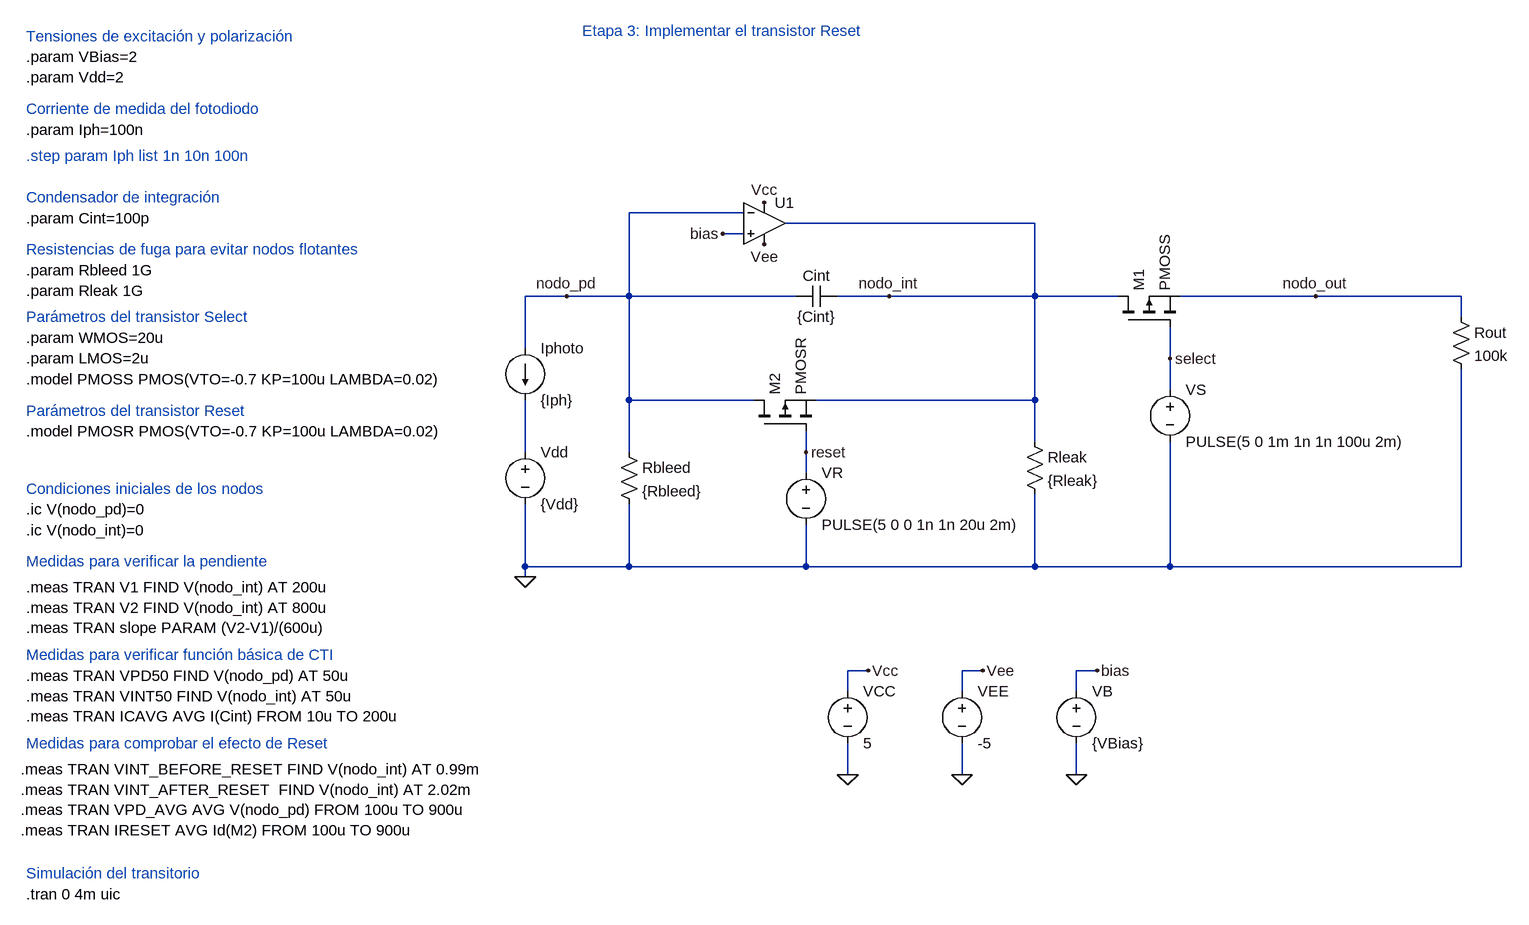
[diagram p0: schematic CTI_Definitivo.asc]
CTI_Definitivo.asc, the LTspice schematic file:
Version 4.1
SHEET 1 2360 1448
WIRE 416 384 240 384
WIRE 864 400 480 400
WIRE 416 416 384 416
WIRE 144 512 80 512
WIRE 240 512 240 384
WIRE 240 512 144 512
WIRE 496 512 240 512
WIRE 640 512 560 512
WIRE 864 512 864 400
WIRE 864 512 640 512
WIRE 992 512 864 512
WIRE 1296 512 1088 512
WIRE 1520 512 1296 512
WIRE 1520 544 1520 512
WIRE 80 592 80 512
WIRE 1072 608 1072 560
WIRE 1072 656 1072 608
WIRE 240 672 240 512
WIRE 432 672 240 672
WIRE 864 672 864 512
WIRE 864 672 528 672
WIRE 864 736 864 672
WIRE 80 752 80 672
WIRE 240 752 240 672
WIRE 512 752 512 720
WIRE 512 784 512 752
WIRE 80 928 80 832
WIRE 240 928 240 832
WIRE 240 928 80 928
WIRE 512 928 512 864
WIRE 512 928 240 928
WIRE 864 928 864 816
WIRE 864 928 512 928
WIRE 1072 928 1072 736
WIRE 1072 928 864 928
WIRE 1520 928 1520 624
WIRE 1520 928 1072 928
WIRE 80 944 80 928
WIRE 608 1088 576 1088
WIRE 784 1088 752 1088
WIRE 960 1088 928 1088
WIRE 576 1120 576 1088
WIRE 752 1120 752 1088
WIRE 928 1120 928 1088
WIRE 576 1248 576 1200
WIRE 752 1248 752 1200
WIRE 928 1248 928 1200
FLAG 80 944 0
FLAG 144 512 nodo_pd
FLAG 640 512 nodo_int
FLAG 960 1088 bias
FLAG 576 1248 0
FLAG 752 1248 0
FLAG 608 1088 Vcc
FLAG 784 1088 Vee
FLAG 448 368 Vcc
FLAG 448 432 Vee
FLAG 384 416 bias
FLAG 928 1248 0
FLAG 1072 608 select
FLAG 1296 512 nodo_out
FLAG 512 752 reset
SYMBOL voltage 928 1104 R0
SYMATTR InstName VB
SYMATTR Value {VBias}
SYMBOL current 80 592 R0
SYMATTR InstName Iphoto
SYMATTR Value {Iph}
SYMBOL cap 496 528 R270
WINDOW 0 32 32 VTop 2
WINDOW 3 0 32 VBottom 2
SYMATTR InstName Cint
SYMATTR Value {Cint}
SYMBOL res 224 736 R0
SYMATTR InstName Rbleed
SYMATTR Value {Rbleed}
SYMBOL res 848 720 R0
SYMATTR InstName Rleak
SYMATTR Value {Rleak}
SYMBOL voltage 80 736 R0
SYMATTR InstName Vdd
SYMATTR Value {Vdd}
SYMBOL OpAmps\\UniversalOpAmp2 448 400 R0
SYMATTR InstName U1
SYMBOL voltage 576 1104 R0
SYMATTR InstName VCC
SYMATTR Value 5
SYMBOL voltage 752 1104 R0
SYMATTR InstName VEE
SYMATTR Value -5
SYMBOL pmos 992 560 R270
SYMATTR InstName M1
SYMATTR Value PMOSS
SYMATTR SpiceLine L={LMOS} W={WMOS}
SYMBOL voltage 1072 640 R0
SYMATTR InstName VS
SYMATTR Value PULSE(5 0 1m 1n 1n 100u 2m)
SYMBOL res 1504 528 R0
SYMATTR InstName Rout
SYMATTR Value 100k
SYMBOL pmos 432 720 R270
SYMATTR InstName M2
SYMATTR Value PMOSR
SYMATTR SpiceLine L={LMOS} W={WMOS}
SYMBOL voltage 512 768 R0
SYMATTR InstName VR
SYMATTR Value PULSE(5 0 0 1n 1n 20u 2m)
TEXT 168 104 Left 2 ;Etapa 3: Implementar el transistor Reset
TEXT -688 112 Left 2 ;Tensiones de excitación y polarización
TEXT -688 144 Left 2 !.param VBias=2\n.param Vdd=2
TEXT -688 224 Left 2 ;Corriente de medida del fotodiodo
TEXT -688 256 Left 2 !.param Iph=100n
TEXT -688 360 Left 2 ;Condensador de integración
TEXT -688 392 Left 2 !.param Cint=100p
TEXT -688 1432 Left 2 !.tran 0 4m uic
TEXT -688 1400 Left 2 ;Simulación del transitorio
TEXT -688 296 Left 2 ;.step param Iph list 1n 10n 100n
TEXT -688 920 Left 2 ;Medidas para verificar la pendiente
TEXT -688 960 Left 2 !.meas TRAN V1 FIND V(nodo_int) AT 200u\n.meas TRAN V2 FIND V(nodo_int) AT 800u\n.meas TRAN slope PARAM (V2-V1)/(600u)
TEXT -688 440 Left 2 ;Resistencias de fuga para evitar nodos flotantes
TEXT -688 472 Left 2 !.param Rbleed 1G
TEXT -688 504 Left 2 !.param Rleak 1G
TEXT -688 640 Left 2 !.model PMOSS PMOS(VTO=-0.7 KP=100u LAMBDA=0.02)
TEXT -688 576 Left 2 !.param WMOS=20u\n.param LMOS=2u
TEXT -688 544 Left 2 ;Parámetros del transistor Select
TEXT -688 1064 Left 2 ;Medidas para verificar función básica de CTI
TEXT -688 1096 Left 2 !.meas TRAN VPD50 FIND V(nodo_pd) AT 50u\n.meas TRAN VINT50 FIND V(nodo_int) AT 50u\n.meas TRAN ICAVG AVG I(Cint) FROM 10u TO 200u
TEXT -688 808 Left 2 ;Condiciones iniciales de los nodos
TEXT -688 840 Left 2 !.ic V(nodo_pd)=0
TEXT -688 872 Left 2 !.ic V(nodo_int)=0
TEXT -688 1200 Left 2 ;Medidas para comprobar el efecto de Reset
TEXT -696 1240 Left 2 !.meas TRAN VINT_BEFORE_RESET FIND V(nodo_int) AT 0.99m\n.meas TRAN VINT_AFTER_RESET  FIND V(nodo_int) AT 2.02m\n.meas TRAN VPD_AVG AVG V(nodo_pd) FROM 100u TO 900u\n.meas TRAN IRESET AVG Id(M2) FROM 100u TO 900u
TEXT -688 688 Left 2 ;Parámetros del transistor Reset
TEXT -688 720 Left 2 !.model PMOSR PMOS(VTO=-0.7 KP=100u LAMBDA=0.02)

The netlist it stands for:
* CTI_Definitivo.asc
VB bias 0 {VBias}
Iphoto nodo_pd N001 {Iph}
Cint nodo_pd nodo_int {Cint}
Rbleed nodo_pd 0 {Rbleed}
Rleak nodo_int 0 {Rleak}
Vdd N001 0 {Vdd}
X§U1 bias nodo_pd Vcc Vee nodo_int level2 Avol=1Meg GBW=10Meg Slew=10Meg Ilimit=25m Rail=0 Vos=0 En=0 Enk=0 In=0 Ink=0 Rin=500Meg  ; pins In+ In- V+ V- OUT
VCC Vcc 0 5
VEE Vee 0 -5
M1 nodo_int select nodo_out nodo_out PMOSS L={LMOS} W={WMOS}
VS select 0 PULSE(5 0 1m 1n 1n 100u 2m)
Rout nodo_out 0 100k
M2 nodo_pd reset nodo_int nodo_int PMOSR L={LMOS} W={WMOS}
VR reset 0 PULSE(5 0 0 1n 1n 20u 2m)
.model NMOS NMOS
.model PMOS PMOS
.lib standard.mos
* Etapa 3: Implementar el transistor Reset
* Tensiones de excitación y polarización
.param VBias=2
.param Vdd=2
* Corriente de medida del fotodiodo
.param Iph=100n
* Condensador de integración
.param Cint=100p
.tran 0 4m uic
* Simulación del transitorio
* .step param Iph list 1n 10n 100n
* Medidas para verificar la pendiente
.meas TRAN V1 FIND V(nodo_int) AT 200u
.meas TRAN V2 FIND V(nodo_int) AT 800u
.meas TRAN slope PARAM (V2-V1)/(600u)
* Resistencias de fuga para evitar nodos flotantes
.param Rbleed 1G
.param Rleak 1G
.model PMOSS PMOS(VTO=-0.7 KP=100u LAMBDA=0.02)
.param WMOS=20u
.param LMOS=2u
* Parámetros del transistor Select
* Medidas para verificar función básica de CTI
.meas TRAN VPD50 FIND V(nodo_pd) AT 50u
.meas TRAN VINT50 FIND V(nodo_int) AT 50u
.meas TRAN ICAVG AVG I(Cint) FROM 10u TO 200u
* Condiciones iniciales de los nodos
.ic V(nodo_pd)=0
.ic V(nodo_int)=0
* Medidas para comprobar el efecto de Reset
.meas TRAN VINT_BEFORE_RESET FIND V(nodo_int) AT 0.99m
.meas TRAN VINT_AFTER_RESET  FIND V(nodo_int) AT 2.02m
.meas TRAN VPD_AVG AVG V(nodo_pd) FROM 100u TO 900u
.meas TRAN IRESET AVG Id(M2) FROM 100u TO 900u
* Parámetros del transistor Reset
.model PMOSR PMOS(VTO=-0.7 KP=100u LAMBDA=0.02)
.lib UniversalOpAmp2.lib
.backanno
.end

* Results of the author's LTspice run, read from the files saved beside the schematic
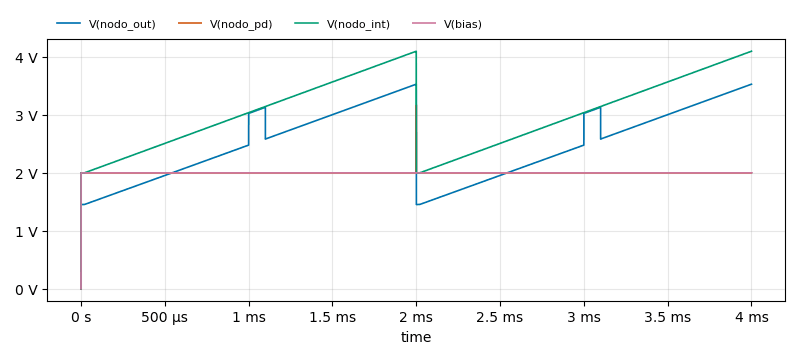
[diagram p1: Transient Analysis of CTI_Definitivo.asc, plotted from the saved traces]
* Transient Analysis, 1 run:
*   V(nodo_out): min 0 V, max 3.53 V, average 2.508 V, rms 2.583 V, last 3.53 V
*   V(nodo_pd): min 0 V, max 3.172 V, average 2 V, rms 2 V, last 2 V
*   V(nodo_int): min 0 V, max 4.099 V, average 3.039 V, rms 3.1 V, last 4.099 V
*   V(bias): min 0 V, max 2 V, average 2 V, rms 2 V, last 2 V
* From the log:
*   v1: V(nodo_int) =2.19087518394 at 0.0002
*   v2: V(nodo_int) =2.82686946707 at 0.0008
*   slope: (V2-V1)/(600u)=1059.99047188
*   vpd50: V(nodo_pd) =1.99999636442 at 5e-05
*   vint50: V(nodo_int) =2.03187624218 at 5e-05
*   icavg: AVG(I(Cint) )=-1.00419969298e-07 FROM 1e-05 TO 0.0002
*   vint_before_reset: V(nodo_int) =3.02825241287 at 0.00099
*   vint_after_reset: V(nodo_int) =2.00007438986 at 0.00202
*   vpd_avg: AVG(V(nodo_pd) )=1.99998042825 FROM 0.0001 TO 0.0009
*   ireset: AVG(Id(M2) )=-1.02774173992e-12 FROM 0.0001 TO 0.0009